# EAGLE design rx (EAGLE 7.6.0)
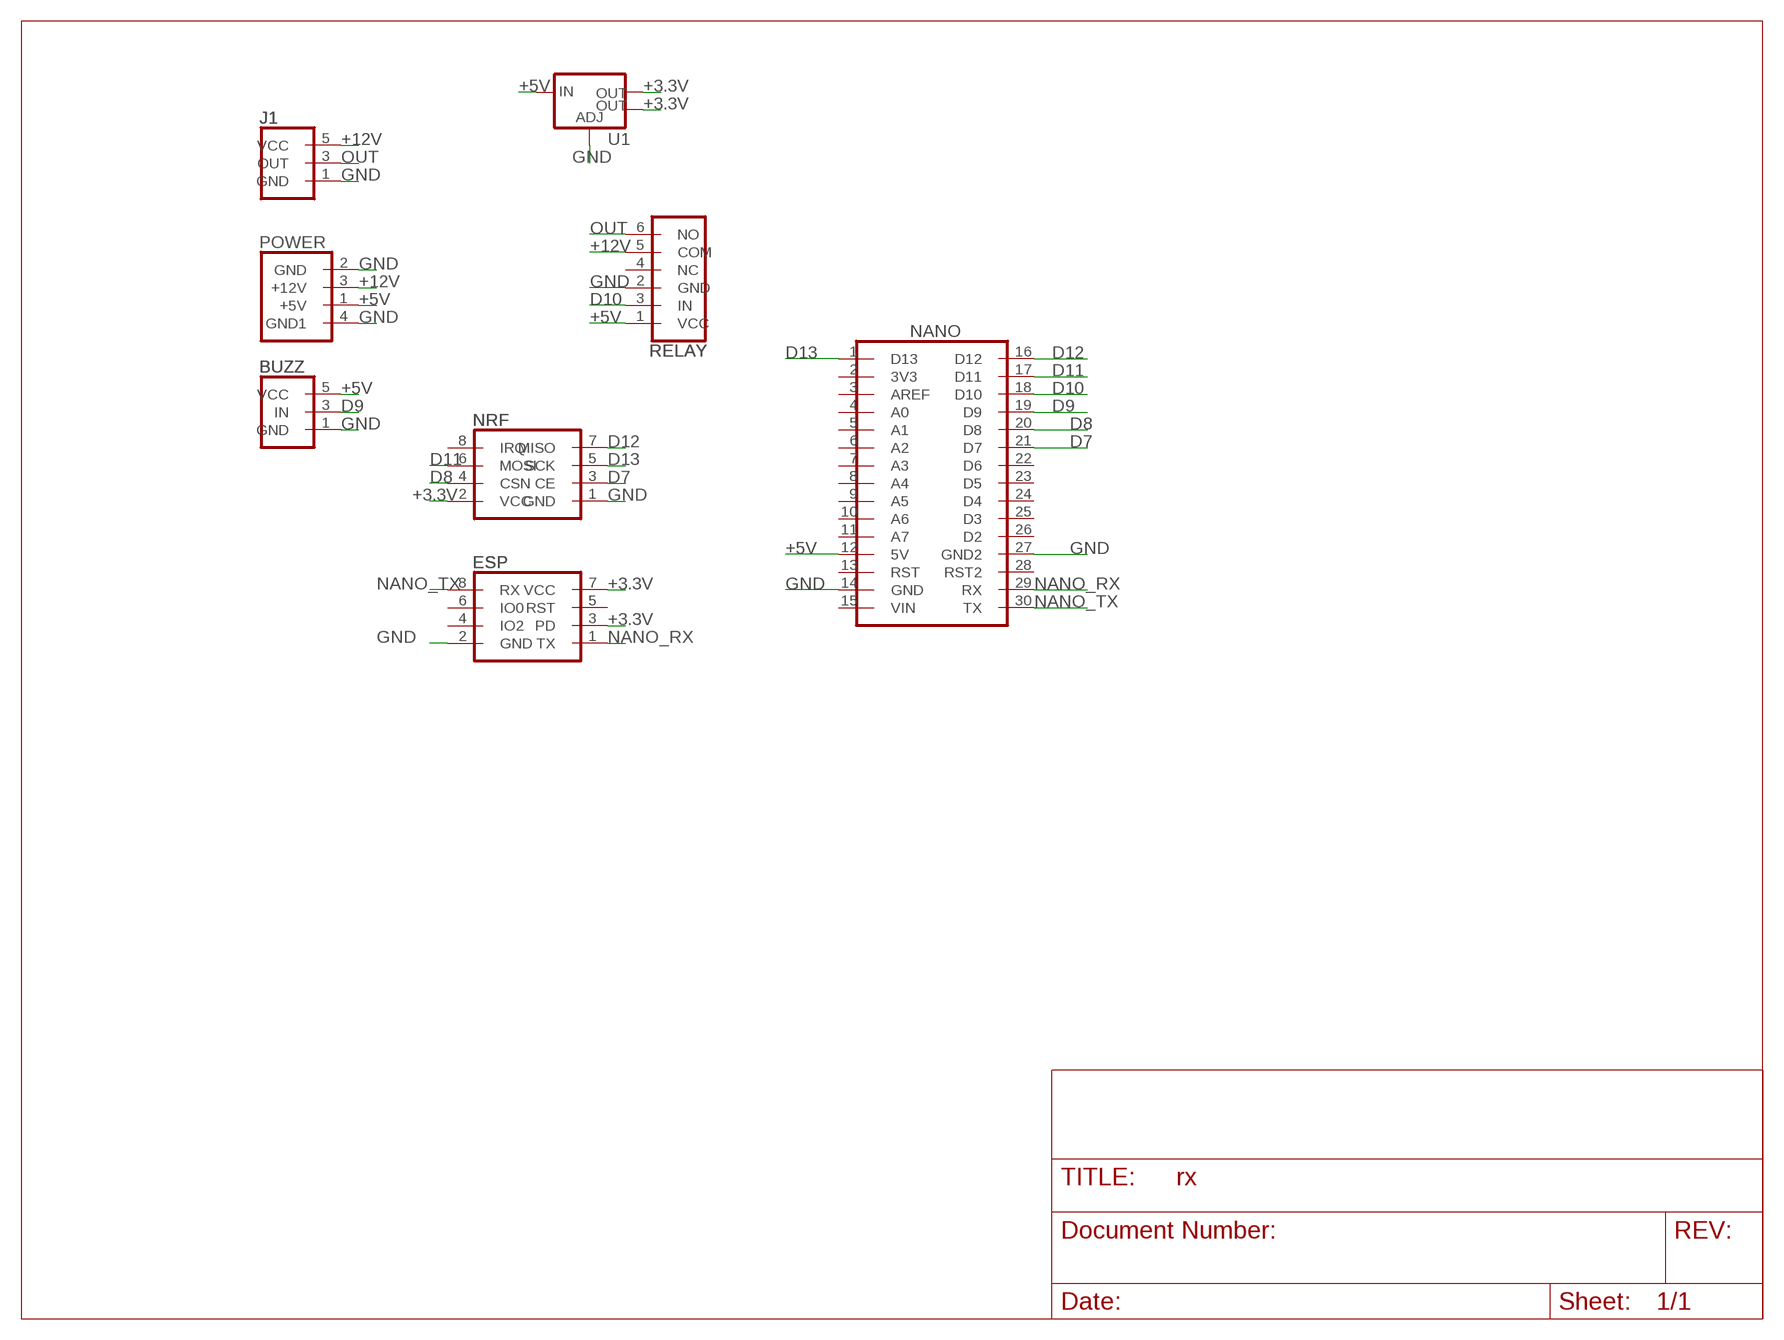
[diagram p0: schematic, sheet 1]

## Parts
BUZZ  BUZZ_MODULE  [BUZZ_MODULE]
ESP  ESP8266_MODULE  [ESP8266]
J1  OUT_HEAD_3BIG  [OUT_HEAD_3_BIG]
NANO  ARDUINO_NANO  [ARDUINO_NANO]
NRF  NRF24L01_MODULE_PA  [NRF24L01_PA]
POWER  POWER_REDUCE  [POWER_REDUCE]
RELAY  RELAY_MODULE  [RELAY_MODULE]
U1  V_REG_LM1117SOT223  [SOT223]

## Nets
+3.3V: ESP.3(PD) ESP.7(VCC) NRF.2(VCC) U1.2(OUT) U1.4(OUT)
+5V: BUZZ.5(VCC) NANO.12(5V) POWER.1(+5V) RELAY.1(VCC) U1.3(IN)
+12V: J1.5(VCC) POWER.3(+12V) RELAY.5(COM)
D7: NANO.21(D7) NRF.3(CE)
D8: NANO.20(D8) NRF.4(CSN)
D9: BUZZ.3(IN) NANO.19(D9)
D10: NANO.18(D10) RELAY.3(IN)
D11: NANO.17(D11) NRF.6(MOSI)
D12: NANO.16(D12) NRF.7(MISO)
D13: NANO.1(D13) NRF.5(SCK)
GND: BUZZ.1(GND) ESP.2(GND) J1.1(GND) NANO.14(GND) NANO.27(GND2) NRF.1(GND) POWER.2(GND) POWER.4(GND1) RELAY.2(GND) U1.1(ADJ)
NANO_RX: ESP.1(TX) NANO.29(RX)
NANO_TX: ESP.8(RX) NANO.30(TX)
OUT: J1.3(OUT) RELAY.6(NO)
Unconnected: ESP.4(IO2) ESP.5(RST) ESP.6(IO0) NANO.2(3V3) NANO.3(AREF) NANO.4(A0) NANO.5(A1) NANO.6(A2) NANO.7(A3) NANO.8(A4) NANO.9(A5) NANO.10(A6) NANO.11(A7) NANO.13(RST) NANO.15(VIN) NANO.22(D6) NANO.23(D5) NANO.24(D4) NANO.25(D3) NANO.26(D2) NANO.28(RST2) NRF.8(IRQ) RELAY.4(NC)

## Library data of the parts
BUZZ = rx:BUZZ_MODULE: Multi connection point. Often used as Generic Header-pin footprint for 0.1 inch spaced/style header connections On any of the 0.1 inch spaced packages, you can populate with these: Break Away Headers - Straight <https://www.sparkfun.com/products/116> (PRT-00116) Break Away Male Headers - Right Angle <https://www.sparkfun.com/products/553> (PRT-00553) Female Headers <https://www.sparkfun.com/products/115> (PRT-00115) Break Away Headers - Machine Pin <https://www.sparkfun.com/products/117> (PRT-00117) Break Away Female Headers - Swiss Machine Pin <https://www.sparkfun.com/products/743> (PRT-00743)
ESP = rx:ESP8266_MODULE: Multi connection point. Often used as Generic Header-pin footprint for 0.1 inch spaced/style header connections On any of the 0.1 inch spaced packages, you can populate with these: Break Away Headers - Straight <https://www.sparkfun.com/products/116> (PRT-00116) Break Away Male Headers - Right Angle <https://www.sparkfun.com/products/553> (PRT-00553) Female Headers <https://www.sparkfun.com/products/115> (PRT-00115) Break Away Headers - Machine Pin <https://www.sparkfun.com/products/117> (PRT-00117) Break Away Female Headers - Swiss Machine Pin <https://www.sparkfun.com/products/743> (PRT-00743)
J1 = rx:OUT_HEAD_3: Multi connection point. Often used as Generic Header-pin footprint for 0.1 inch spaced/style header connections On any of the 0.1 inch spaced packages, you can populate with these: Break Away Headers - Straight <https://www.sparkfun.com/products/116> (PRT-00116) Break Away Male Headers - Right Angle <https://www.sparkfun.com/products/553> (PRT-00553) Female Headers <https://www.sparkfun.com/products/115> (PRT-00115) Break Away Headers - Machine Pin <https://www.sparkfun.com/products/117> (PRT-00117) Break Away Female Headers - Swiss Machine Pin <https://www.sparkfun.com/products/743> (PRT-00743)
NANO = rx:ARDUINO_NANO: Multi connection point. Often used as Generic Header-pin footprint for 0.1 inch spaced/style header connections On any of the 0.1 inch spaced packages, you can populate with these: Break Away Headers - Straight <https://www.sparkfun.com/products/116> (PRT-00116) Break Away Male Headers - Right Angle <https://www.sparkfun.com/products/553> (PRT-00553) Female Headers <https://www.sparkfun.com/products/115> (PRT-00115) Break Away Headers - Machine Pin <https://www.sparkfun.com/products/117> (PRT-00117) Break Away Female Headers - Swiss Machine Pin <https://www.sparkfun.com/products/743> (PRT-00743) For SCREWTERMINALS and SPRING TERMINALS visit here: Screw Terimnals on SparkFun.com <https://www.sparkfun.com/search/results?term=Screw+Terminals> (5mm/3.5mm/2.54mm spacing) This device is also useful as a general connection point to wire up your design to another part of your project. Our various solder wires solder well into these plated through hole pads. Hook-Up Wire - Assortment (Stranded, 22 AWG) <https://www.sparkfun.com/products/11375> (PRT-11375) Hook-Up Wire - Assortment (Solid Core, 22 AWG) <https://www.sparkfun.com/products/11367> (PRT-11367) View the entire wire category on our website here <https://www.sparkfun.com/categories/141> Special notes: Molex polarized connector foot print use with SKU : PRT-08231 with associated crimp pins and housings. 1MM SMD Version SKU: PRT-10208 NOTES ON THE VARIANTS LOCK and LOCK_LONGPADS... This footprint was designed to help hold the alignment of a through-hole component (i.e. 6-pin header) while soldering it into place. You may notice that each hole has been shifted either up or down by 0.005 of an inch from it's more standard position (which is a perfectly straight line). This slight alteration caused the pins (the squares in the middle) to touch the edges of the holes. Because they are alternating, it causes a "brace" to hold the component in place. 0.005 has proven to be the perfect amount of "off-center" position when using our standard breakaway headers. Although looks a little odd when you look at the bare footprint, once you have a header in there, the alteration is very hard to notice. Also,if you push a header all the way into place, it is covered up entirely on the bottom side.
NRF = rx:NRF24L01_MODULE: Multi connection point. Often used as Generic Header-pin footprint for 0.1 inch spaced/style header connections On any of the 0.1 inch spaced packages, you can populate with these: Break Away Headers - Straight <https://www.sparkfun.com/products/116> (PRT-00116) Break Away Male Headers - Right Angle <https://www.sparkfun.com/products/553> (PRT-00553) Female Headers <https://www.sparkfun.com/products/115> (PRT-00115) Break Away Headers - Machine Pin <https://www.sparkfun.com/products/117> (PRT-00117) Break Away Female Headers - Swiss Machine Pin <https://www.sparkfun.com/products/743> (PRT-00743)
POWER = rx:POWER_REDUCE: Multi connection point. Often used as Generic Header-pin footprint for 0.1 inch spaced/style header connections On any of the 0.1 inch spaced packages, you can populate with these: Break Away Headers - Straight <https://www.sparkfun.com/products/116> (PRT-00116) Break Away Male Headers - Right Angle <https://www.sparkfun.com/products/553> (PRT-00553) Female Headers <https://www.sparkfun.com/products/115> (PRT-00115) Break Away Headers - Machine Pin <https://www.sparkfun.com/products/117> (PRT-00117) Break Away Female Headers - Swiss Machine Pin <https://www.sparkfun.com/products/743> (PRT-00743)
RELAY = rx:RELAY_MODULE: Multi connection point. Often used as Generic Header-pin footprint for 0.1 inch spaced/style header connections On any of the 0.1 inch spaced packages, you can populate with these: Break Away Headers - Straight <https://www.sparkfun.com/products/116> (PRT-00116) Break Away Male Headers - Right Angle <https://www.sparkfun.com/products/553> (PRT-00553) Female Headers <https://www.sparkfun.com/products/115> (PRT-00115) Break Away Headers - Machine Pin <https://www.sparkfun.com/products/117> (PRT-00117) Break Away Female Headers - Swiss Machine Pin <https://www.sparkfun.com/products/743> (PRT-00743)
U1 = rx:V_REG_LM1117: Voltage Regulator LM1117 Standard adjustable voltage regulator but in SMD form. Spark Fun Electronics SKU : COM-00595; PROD_ID: VREG-08170

## Board
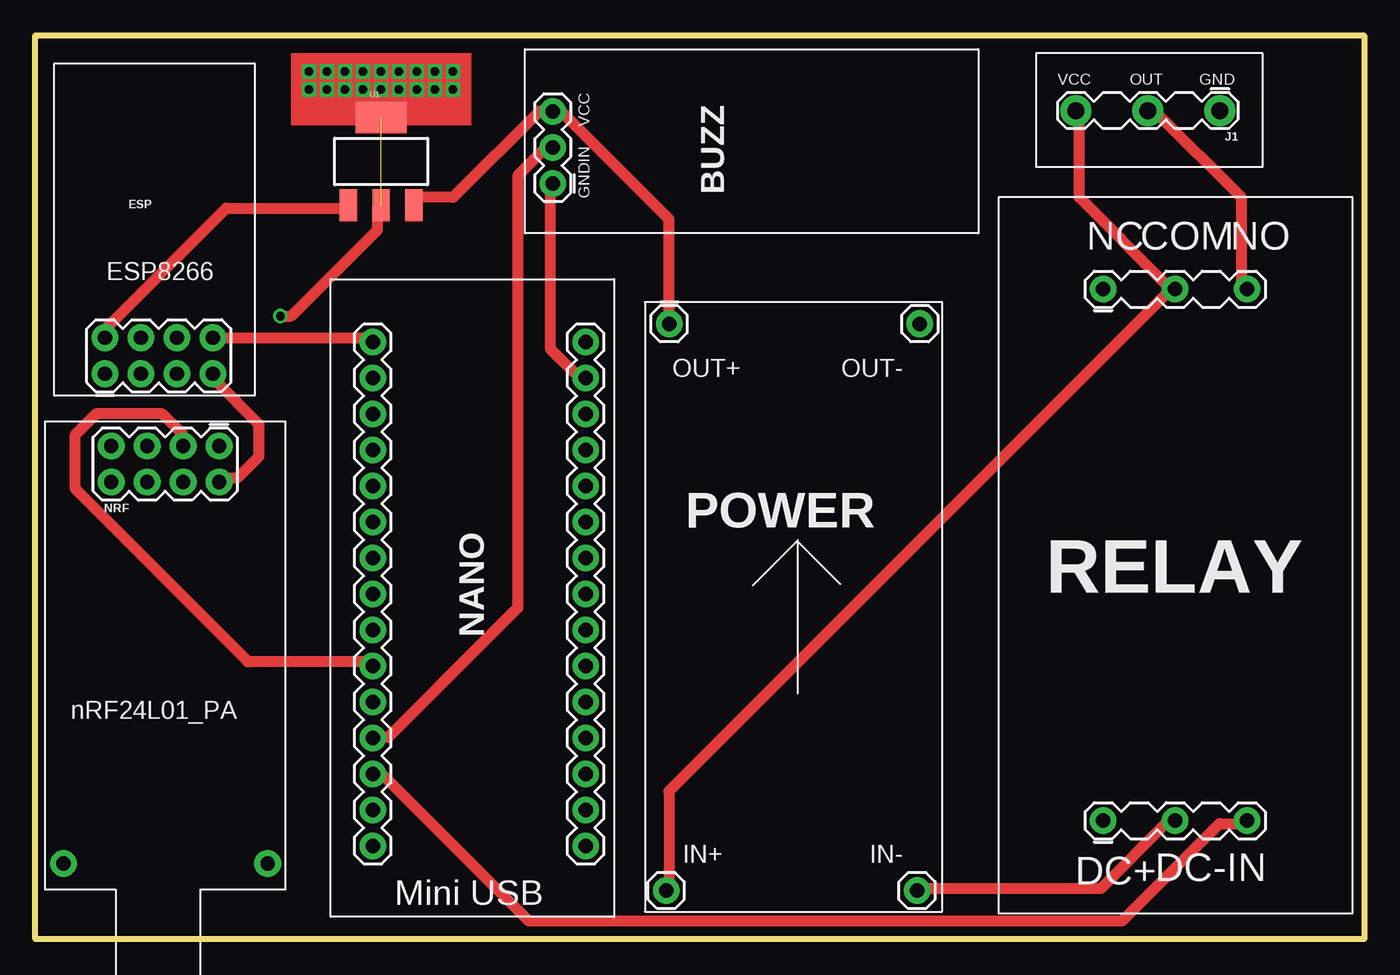
[diagram p1: board, top side]
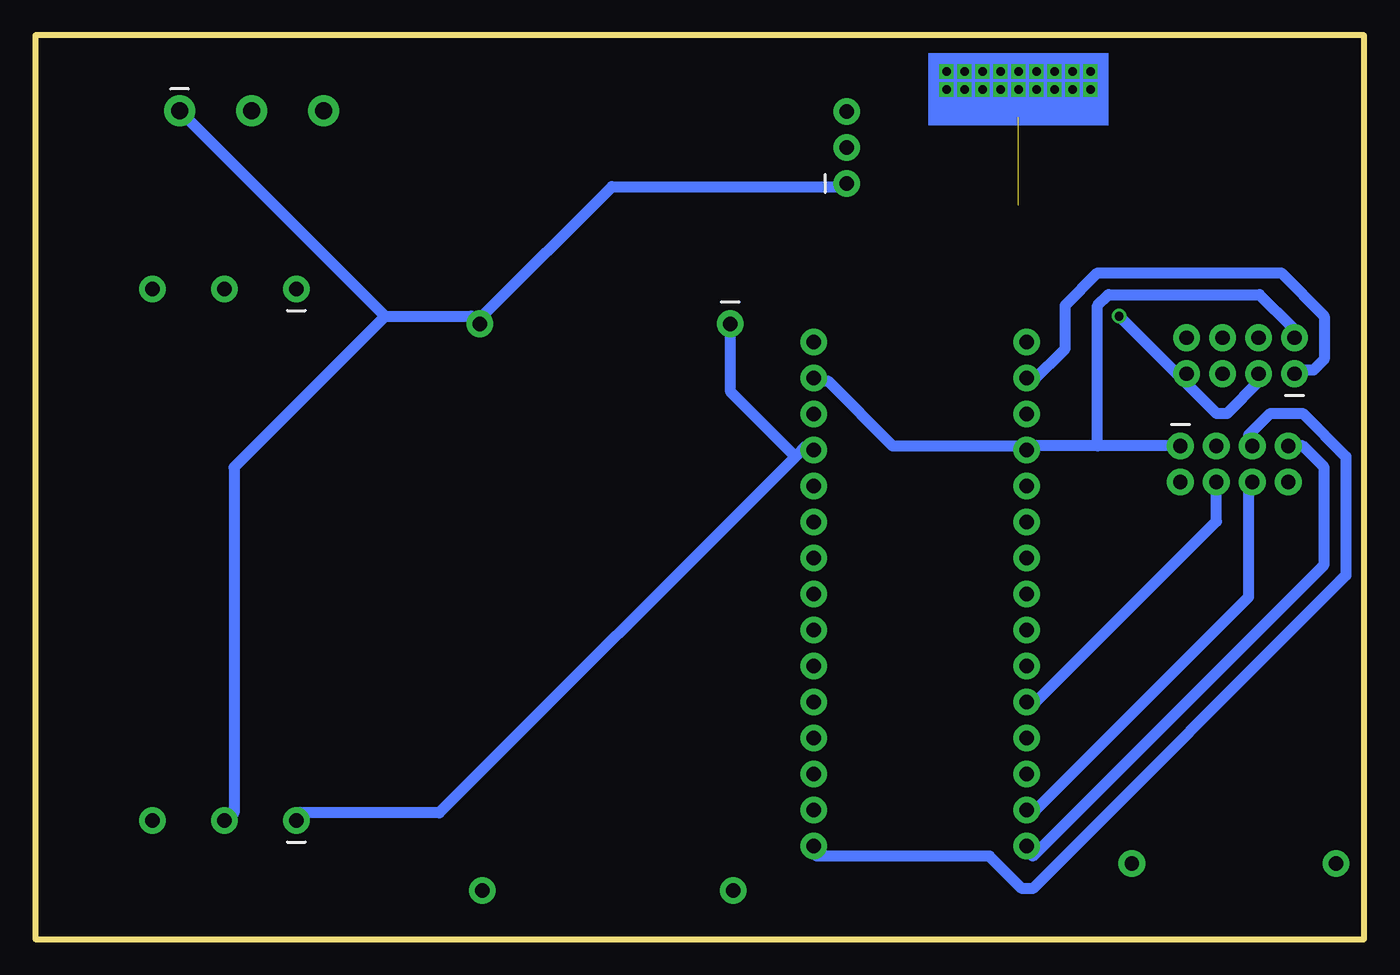
[diagram p2: board, bottom side, seen from below]

Size 93.79 x 63.77 mm. Coordinates in mm from the lower left corner, seen from the top.
Outline: 0,0 0,63.77 93.79,63.77 93.79,0 0,0
Copper layers (1*16): Top 0.035mm / dielectric 1.5mm / Bottom 0.035mm
Design rules "default *": minimum track width 30mil, minimum drill 24mil, track to track 30mil, track to pad 30mil, pad to pad 8mil, via to via 8mil, smd to smd 8mil, copper to edge 40mil, drill to drill 8mil, minimum pad ring 10mil, minimum via ring 8mil, stop-mask expansion 4mil, vias tented up to drill 0mil, thermal gap 10mil

### Footprints (pad centres in the part's own frame; a part is rotated, then mirrored left to right if it is on the bottom)
BUZZ_MODULE = drill 1.016 pad 1.88: 1 3.52,-1.97; 3 6.06,-1.97; 5 8.6,-1.97
ESP8266 = drill 1.016 pad 1.88: 1 -10.61,1.53; 2 -10.61,4.07; 3 -8.07,1.53; 4 -8.07,4.07; 5 -5.53,1.53; 6 -5.53,4.07; 7 -2.99,1.53; 8 -2.99,4.07
OUT_HEAD_3_BIG = drill 1.2 pad 2.184: 1 3.02,4.03; 3 8.1,4.03; 5 13.18,4.03
ARDUINO_NANO = drill 1.016 pad 1.88: 1 -10.2,-8.1; 2 -7.66,-8.1; 3 -5.12,-8.1; 4 -2.58,-8.1; 5 -0.04,-8.1; 6 2.5,-8.1; 7 5.04,-8.1; 8 7.58,-8.1; 9 10.12,-8.1; 10 12.66,-8.1; 11 15.2,-8.1; 12 17.74,-8.1; 13 20.28,-8.1; 14 22.82,-8.1; 15 25.36,-8.1; 16 -10.2,6.93; 17 -7.66,6.93; 18 -5.12,6.93; 19 -2.58,6.93; 20 -0.04,6.93; 21 2.5,6.93; 22 5.04,6.93; 23 7.58,6.93; 24 10.12,6.93; 25 12.66,6.93; 26 15.2,6.93; 27 17.74,6.93; 28 20.28,6.93; 29 22.82,6.93; 30 25.36,6.93
NRF24L01_PA = drill 1.016 pad 1.88: 1 -3.81,-15.47; 2 -3.81,-12.93; 3 -1.27,-15.47; 4 -1.27,-12.93; 5 1.27,-15.47; 6 1.27,-12.93; 7 3.81,-15.47; 8 3.81,-12.93; 9 7.17,13.97; 10 -7.23,13.97
POWER_REDUCE = drill 1.016 pad 1.88: 1 10.15,-20.29; 2 -7.55,-20.29; 3 10.35,19.71; 4 -7.35,19.71
RELAY_MODULE = drill 1.016 pad 1.88: 1 -4.91,-22.38; 2 0.17,-22.38; 3 5.25,-22.38; 4 -4.91,15.12; 5 0.17,15.12; 6 5.25,15.12
SOT223 = smd 1.219 x 2.235: 1 -2.311,-3.099; 2 0,-3.099; 3 2.311,-3.099 | smd 3.6 x 2.2: 4 0,3.099

### Placement (x,y rotation side)
BUZZ  34.56,49.8 90 top
ESP  15.51,38.37 0 top
J1  86.63,62.5 180 top
NANO  30.75,16.78 90 top
NRF  9.16,19.32 180 top
POWER  54.88,23.13 180 top
RELAY  80.28,30.75 0 top
U1  24.4,54.88 0 top

### Tracks (layer width: path | path; a pad name or v marks a point on that pad's centre or on a via)
+3.3V  (via drill 0.61)  (1 unrouted)
  Top 0.762: v17.29,43.96 18.05,43.96 24.15,50.05 24.15,51.58 U1.2 | NRF.2 13.48,32.53 14.24,32.53 15.76,34.05 15.76,36.34 12.72,39.39 ESP.7
  Bottom 0.762: 12.72,39.39 v17.29,43.96 | 12.72,39.39 10.43,37.1 9.67,37.1 7.38,39.39 ESP.3 | 12.72,39.39 ESP.7
+5V
  Top 0.762: U1.3 27.19,52.34 29.48,52.34 35.58,58.44 36.34,58.44 BUZZ.5 37.1,58.44 44.72,50.82 44.72,43.96 POWER.1
  Bottom 0.762: 40.15,34.05 39.39,34.81 NANO.12 | 40.15,34.05 65.29,8.91 75.2,8.91 RELAY.1 | 40.15,34.05 44.72,38.62 44.72,43.2 POWER.1
+12V
  Top 0.762: POWER.3 44.72,3.57 44.72,10.43 79.77,45.48 RELAY.5 79.77,46.24 73.68,52.34 73.68,58.44 J1.5
D7
  Top 0.762: NRF.3 10.43,35.58 8.91,37.1 4.33,37.1 2.81,35.58 2.81,31.77 15,19.57 23.38,19.57 NANO.21
D8
  Bottom 0.762: NRF.4 10.43,29.48 23.38,16.53 NANO.20
D9
  Top 0.762: NANO.19 24.15,14.24 24.91,14.24 34.05,23.38 34.05,53.86 36.34,56.15 BUZZ.3
D10
  Top 0.762: RELAY.3 85.11,8.14 83.58,8.14 76.72,1.29 34.81,1.29 24.15,11.95 NANO.18
D11
  Bottom 0.762: NRF.6 8.14,31.77 8.14,24.15 23.38,8.91 NANO.17
D12
  Bottom 0.762: NRF.7 5.1,34.81 4.33,34.81 2.81,33.29 2.81,26.43 23.38,5.86 NANO.16
D13
  Bottom 0.762: NANO.1 38.62,5.86 26.43,5.86 24.15,3.57 23.38,3.57 1.29,25.67 1.29,34.05 4.33,37.1 6.62,37.1 8.14,35.58 8.14,34.81 NRF.5
GND
  Top 0.762: U1.1 21.86,51.58 13.48,51.58 5.1,43.2 ESP.2 | NANO.14 38.62,39.39 36.34,41.67 36.34,53.1 BUZZ.1 | POWER.4 62.25,3.57 75.2,3.57 79.77,8.14 RELAY.2
  Bottom 0.762: 18.81,34.81 13.48,34.81 NRF.1 | 18.81,34.81 23.38,34.81 NANO.27 24.15,34.81 33.29,34.81 37.86,39.39 38.62,39.39 NANO.14 | 18.81,34.81 18.81,44.72 18.05,45.48 7.38,45.48 5.1,43.2 ESP.2 | 69.1,43.96 63.01,43.96 POWER.2 62.25,43.96 53.1,53.1 37.1,53.1 BUZZ.1 | 69.1,43.96 83.58,58.44 J1.1 | 69.1,43.96 79.77,33.29 79.77,8.91 RELAY.2
N$1  (via drill 0.6)
  other vias: 19.32,61.23
N$2  (via drill 0.6)
  other vias: 20.59,61.23
N$3  (via drill 0.6)
  other vias: 21.86,61.23
N$4  (via drill 0.6)
  other vias: 23.13,61.23
N$5  (via drill 0.6)
  other vias: 24.4,61.23
N$6  (via drill 0.6)
  other vias: 25.67,61.23
N$7  (via drill 0.6)
  other vias: 26.94,61.23
N$8  (via drill 0.6)
  other vias: 28.21,61.23
N$9  (via drill 0.6)
  other vias: 29.48,61.23
N$10  (via drill 0.6)
  other vias: 29.48,59.96
N$11  (via drill 0.6)
  other vias: 28.21,59.96
N$12  (via drill 0.6)
  other vias: 26.94,59.96
N$13  (via drill 0.6)
  other vias: 25.67,59.96
N$14  (via drill 0.6)
  other vias: 24.4,59.96
N$15  (via drill 0.6)
  other vias: 23.13,59.96
N$16  (via drill 0.6)
  other vias: 21.86,59.96
N$17  (via drill 0.6)
  other vias: 20.59,59.96
N$18  (via drill 0.6)
  other vias: 19.32,59.96
NANO_RX
  Bottom 0.762: ESP.1 4.33,40.15 3.57,40.15 2.81,40.91 2.81,43.96 5.86,47.01 18.81,47.01 21.1,44.72 21.1,41.67 23.38,39.39 NANO.29
NANO_TX
  Top 0.762: NANO.30 23.38,42.43 12.72,42.43 ESP.8
OUT
  Top 0.762: RELAY.6 85.11,46.24 85.11,52.34 79.01,58.44 J1.3
(copper drawn outside any net)
  shapes: Bottom area x1, Top area x1